# EAGLE design LED-RingCoder (EAGLE 6.5.0)
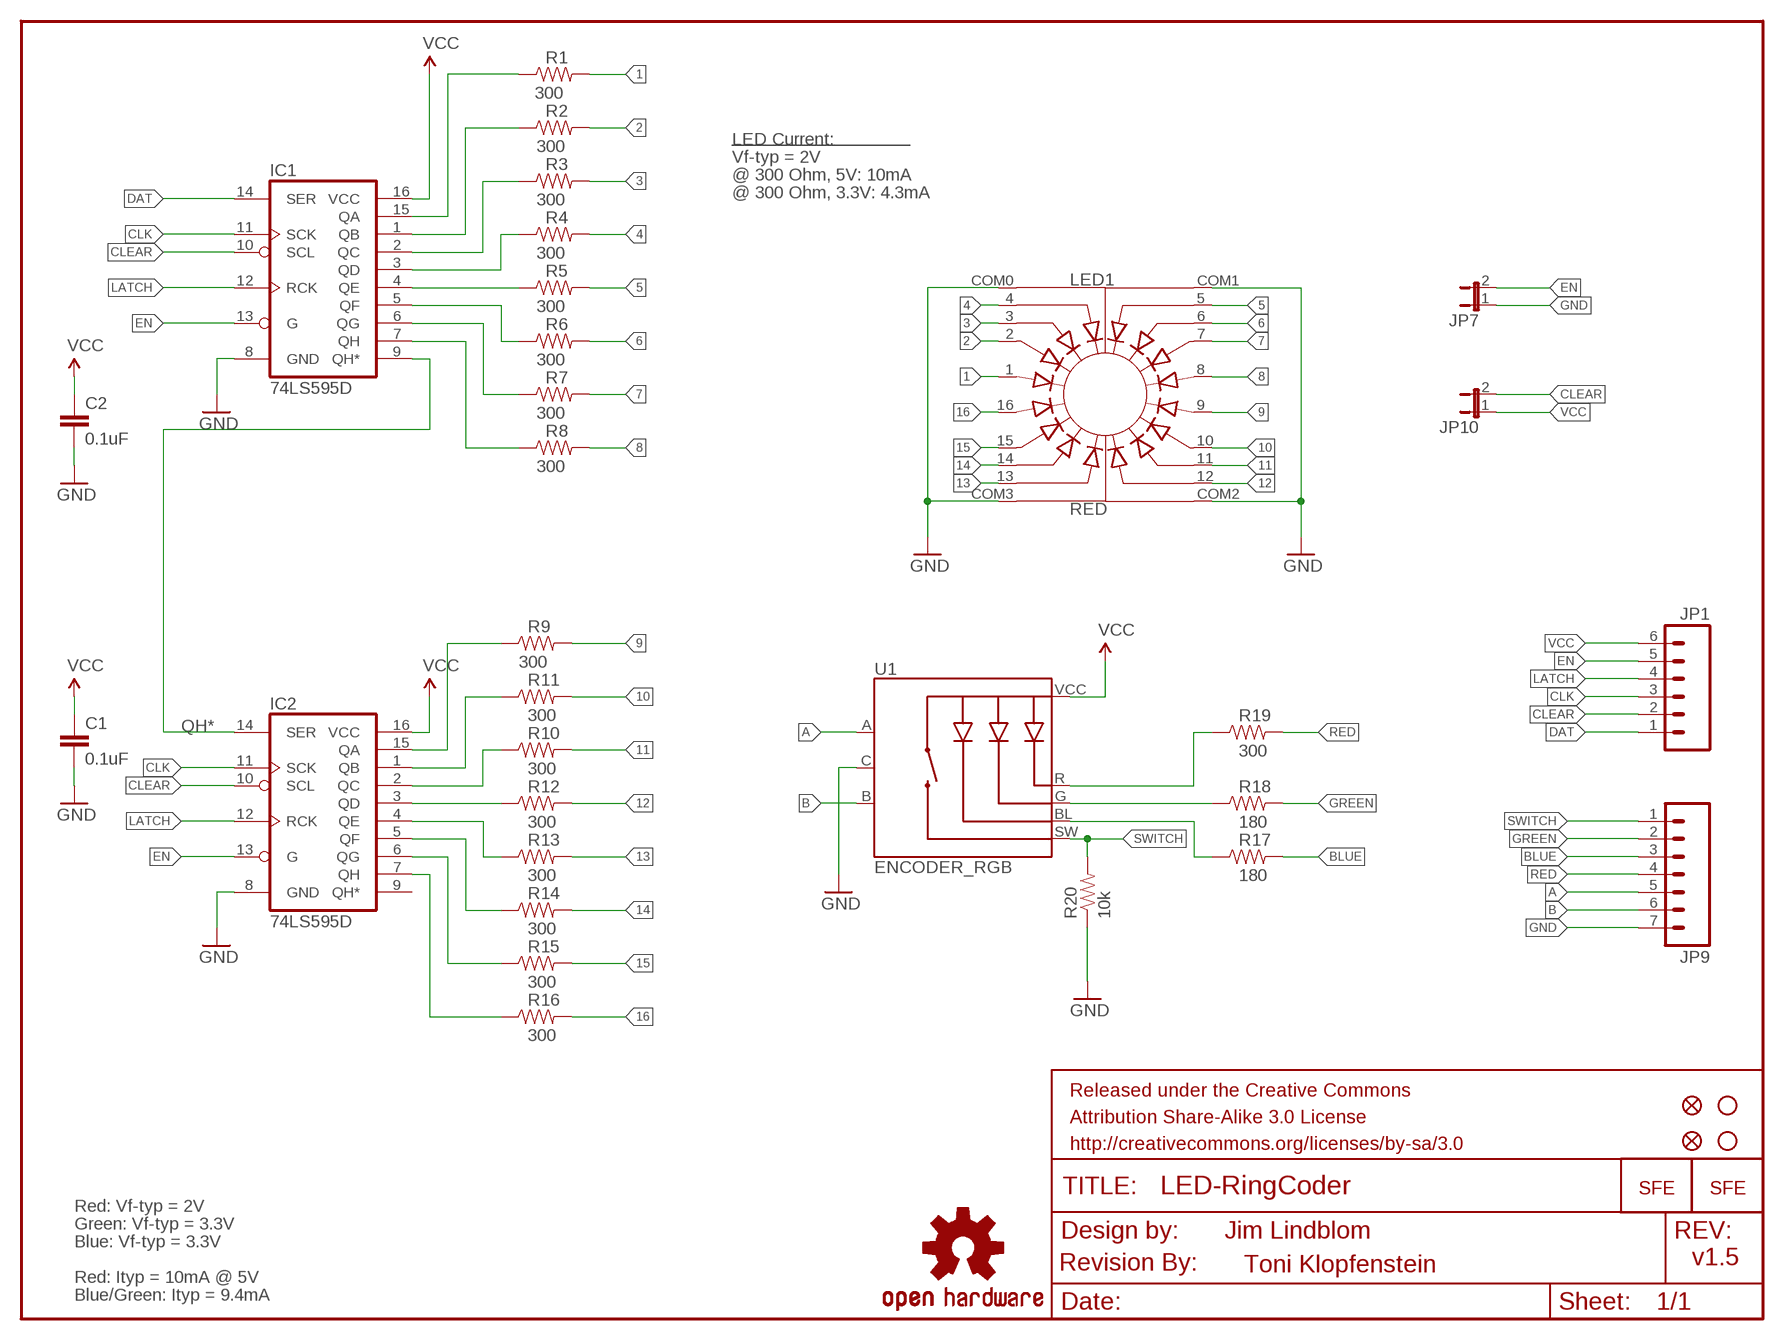
[diagram p0: schematic, sheet 1]

## Parts
C1  0.1uF  0.1UF-25V(+80/-20%)(0603)  [0603-CAP]
C2  0.1uF  0.1UF-25V(+80/-20%)(0603)  [0603-CAP]
FRAME1  FRAME-LETTER  [CREATIVE_COMMONS]
IC1  74LS595D  [SO16]
IC2  74LS595D  [SO16]
JP1  M06SIP  [1X06]
JP2  LOGO-SFENW2  [SFE-NEW-WEB]
JP3  STAND-OFF  [STAND-OFF]
JP4  STAND-OFF  [STAND-OFF]
JP5  FIDUCIAL1X2.5  [FIDUCIAL-1X2.5]
JP6  LOGO-SFESK  [SFE-LOGO-FLAME]
JP7  JUMPER-2SMD-NC  [SJ_2S]
JP8  FIDUCIAL1X2.5  [FIDUCIAL-1X2.5]
JP9  M07  [1X07]
JP10  JUMPER-2SMD-NC  [SJ_2S]
LED1  RED  LED_RING  [LED_RING]
R1  300  300OHM-1/10W-1%(0603)  [0603-RES]
R2  300  300OHM-1/10W-1%(0603)  [0603-RES]
R3  300  300OHM-1/10W-1%(0603)  [0603-RES]
R4  300  300OHM-1/10W-1%(0603)  [0603-RES]
R5  300  300OHM-1/10W-1%(0603)  [0603-RES]
R6  300  300OHM-1/10W-1%(0603)  [0603-RES]
R7  300  300OHM-1/10W-1%(0603)  [0603-RES]
R8  300  300OHM-1/10W-1%(0603)  [0603-RES]
R9  300  300OHM-1/10W-1%(0603)  [0603-RES]
R10  300  300OHM-1/10W-1%(0603)  [0603-RES]
R11  300  300OHM-1/10W-1%(0603)  [0603-RES]
R12  300  300OHM-1/10W-1%(0603)  [0603-RES]
R13  300  300OHM-1/10W-1%(0603)  [0603-RES]
R14  300  300OHM-1/10W-1%(0603)  [0603-RES]
R15  300  300OHM-1/10W-1%(0603)  [0603-RES]
R16  300  300OHM-1/10W-1%(0603)  [0603-RES]
R17  180  180OHM1/10W1%(0603)  [0603-RES]
R18  180  180OHM1/10W1%(0603)  [0603-RES]
R19  300  300OHM-1/10W-1%(0603)  [0603-RES]
R20  10k  10KOHM1/10W1%(0603)0603  [0603-RES]
U1  ENCODER_RGB  [ENCODER_LED_RGB]
U$1  REVISION  [REVISION]
U$2  OSHW-LOGOS  [OSHW-LOGO-S]

## Nets
1: LED1.1 R1.2
2: LED1.2 R2.2
3: LED1.3 R3.2
4: LED1.4 R4.2
5: LED1.5 R5.2
6: LED1.6 R6.2
7: LED1.7 R7.2
8: LED1.8 R8.2
9: LED1.9 R9.2
10: LED1.10 R11.2
11: LED1.11 R10.2
12: LED1.12 R12.2
13: LED1.13 R13.2
14: LED1.14 R14.2
15: LED1.15 R15.2
16: LED1.16 R16.2
A: JP9.5 U1.A
B: JP9.6 U1.B
BLUE: JP9.3 R17.2
CLEAR: IC1.10(SCL) IC2.10(SCL) JP1.2 JP10.2
CLK: IC1.11(SCK) IC2.11(SCK) JP1.3
DAT: IC1.14(SER) JP1.1
EN: IC1.13(G) IC2.13(G) JP1.5 JP7.2
GND: C1.2 C2.2 IC1.8(GND) IC2.8(GND) JP7.1 JP9.7 LED1.COM0 LED1.COM1 LED1.COM2 LED1.COM3 R20.1 U1.C
GREEN: JP9.2 R18.2
LATCH: IC1.12(RCK) IC2.12(RCK) JP1.4
LED-B: R17.1 U1.BL
LED-G: R18.1 U1.G
LED-R: R19.1 U1.R
N$1: IC1.15(QA) R1.1
N$2: IC1.1(QB) R2.1
N$3: IC1.2(QC) R3.1
N$4: IC1.3(QD) R4.1
N$5: IC1.4(QE) R5.1
N$6: IC1.5(QF) R6.1
N$7: IC1.6(QG) R7.1
N$8: IC1.7(QH) R8.1
N$9: IC2.15(QA) R9.1
N$10: IC2.1(QB) R11.1
N$11: IC2.2(QC) R10.1
N$12: IC2.3(QD) R12.1
N$13: IC2.4(QE) R13.1
N$14: IC2.5(QF) R14.1
N$15: IC2.6(QG) R15.1
N$16: IC2.7(QH) R16.1
QH*: IC1.9(QH*) IC2.14(SER)
RED: JP9.4 R19.2
SWITCH: JP9.1 R20.2 U1.SW
VCC: C1.1 C2.1 IC1.16(VCC) IC2.16(VCC) JP1.6 JP10.1 U1.VCC
Unconnected: IC2.9(QH*)

## Notes on the sheet
- LED Current:
- Vf-typ = 2V
- @ 300 Ohm, 5V: 10mA
- @ 300 Ohm, 3.3V: 4.3mA
- Red: Vf-typ = 2V
- Green: Vf-typ = 3.3V
- Jim Lindblom
- Blue: Vf-typ = 3.3V
- v1.5
- Toni Klopfenstein
- Red: Ityp = 10mA @ 5V
- Blue/Green: Ityp = 9.4mA

## Library data of the parts
C1 C2 = SparkFun-Capacitors:0.1UF-25V(+80/-20%)(0603): CAP-00810 Ceramic Standard decoupling cap; PROD_ID: CAP-00810
FRAME1 = SparkFun-Aesthetics:FRAME-LETTER: Schematic Frame Standard 8.5x11 US Letter frame
IC1 IC2 = SparkFun-DigitalIC:74*595: 8-bit SHIFT REGISTER, output latch
JP1 = SparkFun:M06: Header 6 Standard 6-pin 0.1" header. Use with straight break away headers (SKU : PRT-00116), right angle break away headers (PRT-00553), swiss pins (PRT-00743), machine pins (PRT-00117), and female headers (PRT-00115). Molex polarized connector foot print use with SKU : PRT-08094 with associated crimp pins and housings. NOTES ON THE VARIANTS LOCK and LOCK_LONGPADS... This footprint was designed to help hold the alignment of a through-hole component (i.e. 6-pin header) while soldering it into place. You may notice that each hole has been shifted either up or down by 0.005 of an inch from it's more standard position (which is a perfectly straight line). This slight alteration caused the pins (the squares in the middle) to touch the edges of the holes. Because they are alternating, it causes a "brace" to hold the component in place. 0.005 has proven to be the perfect amount of "off-center" position when using our standard breakaway headers. Although looks a little odd when you look at the bare footprint, once you have a header in there, the alteration is very hard to notice. Also, if you push a header all the way into place, it is covered up entirely on the bottom side. This idea of altering the position of holes to aid alignment will be further integrated into the Sparkfun Library for other footprints. It can help hold any component with 3 or more connection pins.
JP2 JP6 = SparkFun:LOGO-SFE: Spark Fun Electronics PCB Logo This is the standard Spark Fun Electronics PCB logo.
JP3 JP4 = SparkFun:STAND-OFF: Stand Off This is the mechanical footprint for a #4 phillips button head screw. Use the keepout ring to avoid running the screw head into surrounding components. SKU : PRT-00447
JP5 JP8 = abes:FIDUCIAL: Fiducial Alignment Points Various fiducial points for machine vision alignment.
JP7 JP10 = SparkFun-Passives:JUMPER-2: Jumper Basic 0.1" spaced jumper. Use with breakaway headers.
JP9 = SparkFun:M07: Header 7 Standard 7-pin 0.1" header. Use with straight break away headers (SKU : PRT-00116), right angle break away headers (PRT-00553), swiss pins (PRT-00743), machine pins (PRT-00117), and female headers (PRT-00115). NOTES ON THE VARIANTS LOCK and LOCK_LONGPADS... This footprint was designed to help hold the alignment of a through-hole component (i.e. 7-pin header) while soldering it into place. You may notice that each hole has been shifted either up or down by 0.005 of an inch from it's more standard position (which is usually a perfectly straight line). This slight alteration caused the pins (the squares in the middle) to touch the edges of the holes. Because they are alternating, it causes a "brace" to hold the header in place. 0.005 has proven to be the perfect amount of "off-center" position when using our standard breakaway headers. Although looks a little odd when you look at the bare footprint, once you have a header in there, the alteration is very hard to notice. Also, if you push a header all the way into place, it is covered up entirely on the bottom side. This idea of altering the position of holes to aid alignment will be further integrated into the Sparkfun Library for other footprints. It can help hold any component with 3 or more connection pins.
LED1 = SparkFun:LED_RING: 16 LED Ring http://dlnmh9ip6v2uc.cloudfront.net/datasheets/Components/LED/Top-Up%20LED%20Ring%20LED-CCL-A.pdf
R1-R16 R19 = SparkFun-Resistors:300OHM-1/10W-1%(0603): RES-10328; PROD_ID: RES_10328
R17 R18 = SparkFun-Resistors:180OHM1/10W1%(0603): RES-08788; PROD_ID: RES-08788
R20 = SparkFun-Resistors:10KOHM1/10W1%(0603): RES-00824; PROD_ID: RES-00824; VALUE: 10K
U1 = SparkFun:ENCODER_RGB: Illuminated Rotary Encoder w/ RGB LED and select switch EC12PLRGBSDVBF-D: http://top-up.so-buy.com/front/bin/ptdetail.phtml?Part=EC12PLRGBSDVBF-D
U$1 = SparkFun-Aesthetics:REVISION
U$2 = SparkFun:OSHW-LOGO: Open Source Hardware Logo This logo indicates the piece of hardware it is found on incorporates a OSHW license and/or adheres to the definition of open source hardware found here: http://freedomdefined.org/OSHW

## Board
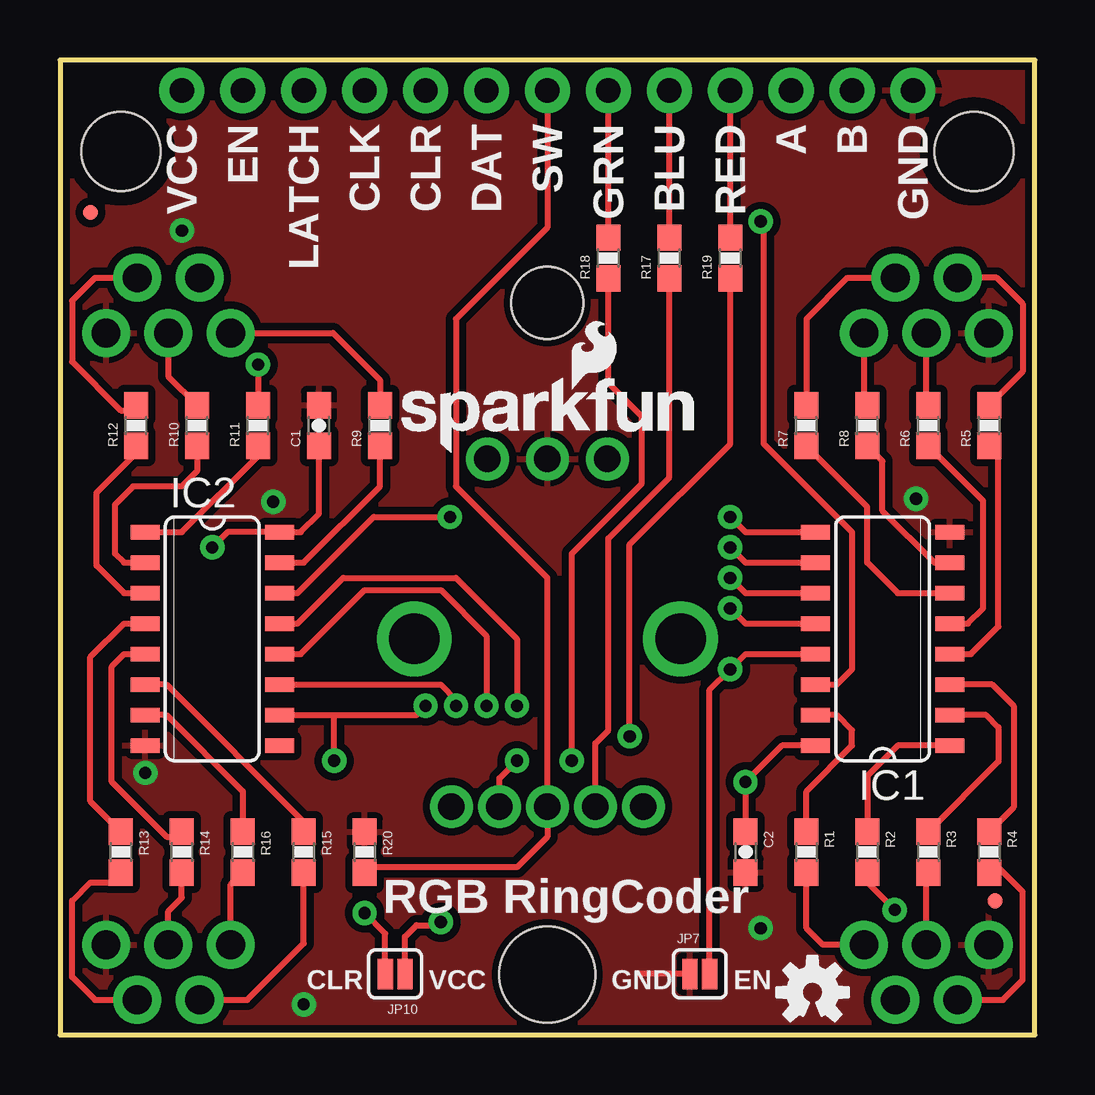
[diagram p1: board, top side]
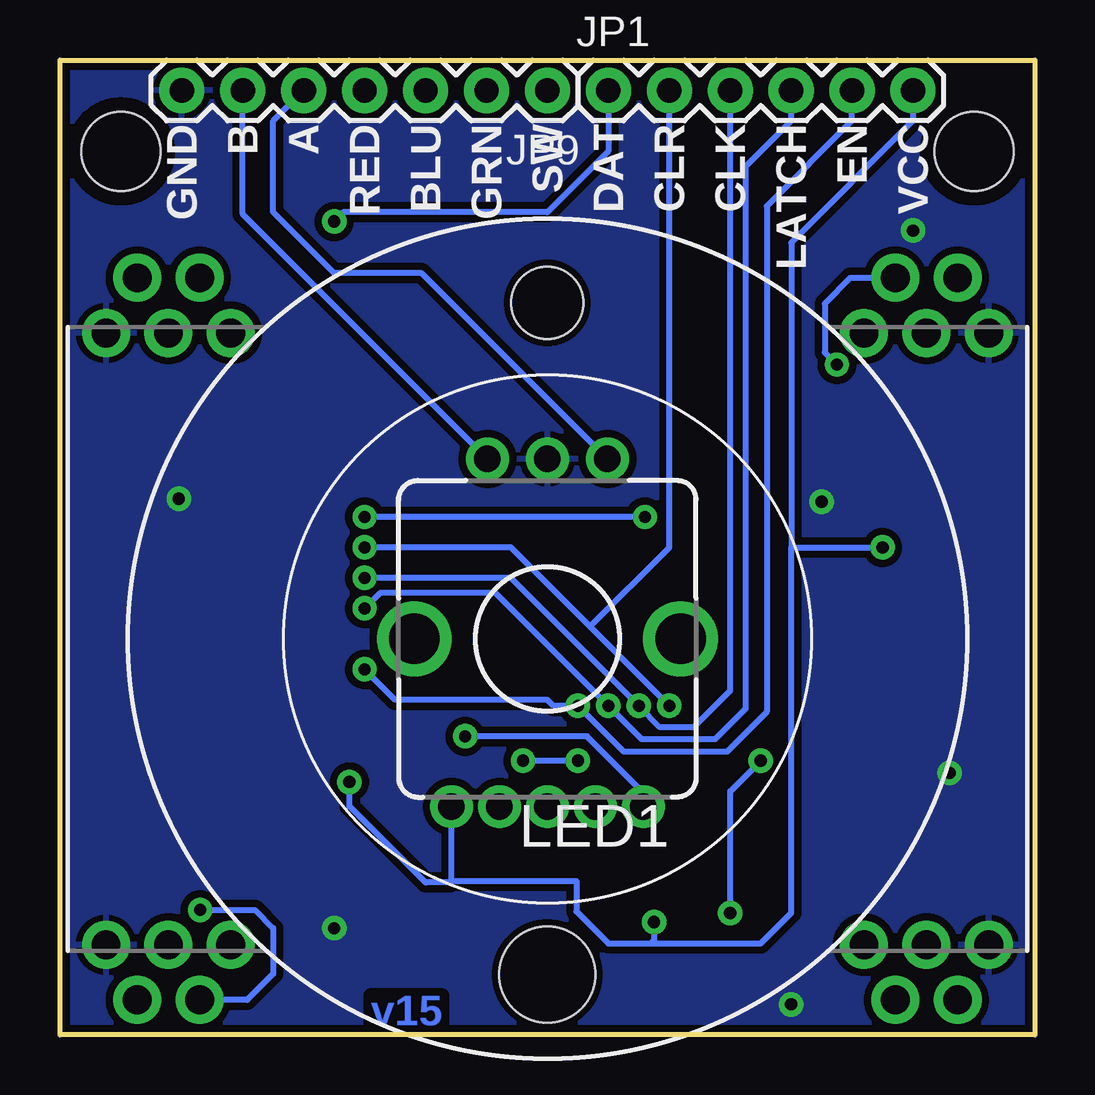
[diagram p2: board, bottom side, seen from below]

Size 40.64 x 40.64 mm. Coordinates in mm from the lower left corner, seen from the top.
Outline: 40.64,0 40.64,40.64 0,40.64 0,0 40.64,0
Copper layers (1*16): Top 0.035mm / dielectric 1.5mm / Bottom 0.035mm
Design rules "SparkFun *": minimum track width 8mil, minimum drill 20mil, track to track 8mil, track to pad 8mil, pad to pad 8mil, via to via 8mil, smd to smd 8mil, copper to edge 8mil, drill to drill 8mil, minimum pad ring 12mil, minimum via ring 10mil, stop-mask expansion 4mil, vias tented up to drill 20mil, thermal gap 10mil

### Footprints (pad centres in the part's own frame; a part is rotated, then mirrored left to right if it is on the bottom)
0603-CAP = smd 1.1 x 1: 1 -0.85,0; 2 0.85,0
SO16 = smd 0.6 x 1.2: 1 -4.445,-2.8; 2 -3.175,-2.8; 3 -1.905,-2.8; 4 -0.635,-2.8; 5 0.635,-2.8; 6 1.905,-2.8; 7 3.175,-2.8; 8 4.445,-2.8; 9 4.445,2.8; 10 3.175,2.8; 11 1.905,2.8; 12 0.635,2.8; 13 -0.635,2.8; 14 -1.905,2.8; 15 -3.175,2.8; 16 -4.445,2.8
1X06 = drill 1.016 pad 1.88: 1 0,0; 2 2.54,0; 3 5.08,0; 4 7.62,0; 5 10.16,0; 6 12.7,0
STAND-OFF = hole 3.302: 0,0
FIDUCIAL-1X2.5 = smd 0.635 x 0.635: 1 0,0
SJ_2S = smd 0.635 x 1.27: 1 -0.412,0; 2 0.412,0
1X07 = drill 1.016 pad 1.88: 1 0,0; 2 2.54,0; 3 5.08,0; 4 7.62,0; 5 10.16,0; 6 12.7,0; 7 15.24,0
LED_RING = drill 1.2 pad 2: 1 13.2,12.75; 2 14.5,15.05; 3 15.8,12.75; 4 17.1,15.05; 5 17.1,-15.05; 6 15.8,-12.75; 7 14.5,-15.05; 8 13.2,-12.75; 9 -13.2,-12.75; 10 -14.5,-15.05; 11 -15.8,-12.75; 12 -17.1,-15.05; 13 -17.1,15.05; 14 -15.8,12.75; 15 -14.5,15.05; 16 -13.2,12.75; COM0 18.4,12.75; COM1 18.4,-12.75; COM2 -18.4,-12.75; COM3 -18.4,12.75 | hole 4: 0,14 | hole 3: 0,-14
0603-RES = smd 1.1 x 1: 1 -0.85,0; 2 0.85,0
ENCODER_LED_RGB = drill 1.1 pad 1.8: A -2.5,-7.5; B 2.5,-7.5; C 0,-7.5 | drill 1.1 pad 1.778: BL 2,7; G -2,7; R -4,7; SW 0,7; VCC 4,7 | drill 2.1: P$1 -5.55,0; P$2 5.55,0

### Placement (x,y rotation side)
C1  10.79,25.4 90 top
C2  28.57,7.62 270 top
FRAME1  -3.28,-9.53 0 top  (outside the outline)
IC1  34.29,16.51 90 top
IC2  6.35,16.51 270 top
JP1  17.78,39.37 0 bottom
JP2  14.22,24.26 0 top
JP3  38.1,36.83 0 bottom
JP4  2.54,36.83 0 bottom
JP5  38.99,5.59 0 top
JP6  21.34,26.92 0 top
JP7  26.67,2.54 0 top
JP8  1.27,34.29 0 top
JP9  20.32,39.37 180 bottom
JP10  13.97,2.54 180 top
LED1  20.32,16.51 180 bottom
R1  31.11,7.62 270 top
R2  33.66,7.62 270 top
R3  36.2,7.62 270 top
R4  38.73,7.62 270 top
R5  38.73,25.4 90 top
R6  36.2,25.4 90 top
R7  31.11,25.4 90 top
R8  33.66,25.4 90 top
R9  13.34,25.4 90 top
R10  5.71,25.4 90 top
R11  8.26,25.4 90 top
R12  3.17,25.4 90 top
R13  2.54,7.62 270 top
R14  5.08,7.62 270 top
R15  10.16,7.62 270 top
R16  7.62,7.62 270 top
R17  25.4,32.38 90 top
R18  22.86,32.38 90 top
R19  27.94,32.38 90 top
R20  12.7,7.62 270 top
U1  20.32,16.51 180 bottom
U$1  8.26,-12.7 0 top  (outside the outline)
U$2  31.37,1.78 0 top

### Tracks (layer width: path | path; a pad name or v marks a point on that pad's centre or on a via)
1
  Top 0.254: LED1.1 31.8,3.76 31.11,4.45 R1.2
2  (via drill 0.51)
  Top 0.254: R2.2 33.44,6.77 33.44,6.57 v34.8,5.21
  Bottom 0.254: LED1.2 32.83,1.46 31.75,2.54 31.75,4.45 32.51,5.21 v34.8,5.21
3
  Top 0.254: LED1.3 36.12,6.7 R3.2
4
  Top 0.254: LED1.4 39.31,1.46 40.13,2.29 40.13,5.97 39.13,6.97 38.94,6.97 R4.2
5
  Top 0.254: LED1.5 39.05,31.56 40.13,30.48 40.13,27.65 R5.2
6
  Top 0.254: LED1.6 36.12,26.32 R6.2
7
  Top 0.254: LED1.7 32.83,31.56 31.11,29.84 R7.2
8
  Top 0.254: LED1.8 33.52,26.39 R8.2
9
  Top 0.254: LED1.9 11.38,29.26 13.34,27.3 R9.2
10  (via drill 0.51)
  Top 0.254: 8.04,26.04 R11.2 v8.26,27.94
  Bottom 0.254: LED1.10 7.68,31.56 8.76,30.48 8.76,28.45 v8.26,27.94
11
  Top 0.254: LED1.11 4.52,27.45 R10.2
12
  Top 0.254: LED1.12 1.46,31.56 0.51,30.61 0.51,28.07 2.54,26.04 2.96,26.04 R12.2
13
  Top 0.254: LED1.13 1.46,1.46 0.51,2.41 0.51,5.59 1.27,6.35 2.12,6.35 R13.2
14
  Top 0.254: LED1.14 4.52,5.16 5.08,5.71 R14.2
15
  Top 0.254: LED1.15 7.81,1.46 10.16,3.81 R15.2
16
  Top 0.254: LED1.16 7.12,6.27 R16.2
A
  Bottom 0.254: U1.A 25.56,31.75 29.21,31.75 31.75,34.29 31.75,38.1 JP9.5
B
  Bottom 0.254: JP9.6 33.02,34.21 U1.B
BLUE
  Top 0.254: R17.2 JP9.3
CLEAR  (via drill 0.51)
  Top 0.254: IC1.10 28.57,19.68 v27.94,20.32 | IC2.10 11.43,13.34 | 11.43,13.34 14.86,13.34 v15.24,13.72 | JP10.2 13.56,4.22 v12.7,5.08 | v11.43,11.43 11.43,13.34
  Bottom 0.254: v15.24,13.72 18.54,17.02 | 18.54,17.02 21.84,20.32 v27.94,20.32 | JP1.2 15.24,20.32 18.54,17.02 | v12.7,5.08 12.7,10.16 v11.43,11.43
CLK  (via drill 0.51)
  Top 0.254: IC1.11 28.57,18.41 v27.94,19.05 | IC2.11 15.88,14.61 16.51,13.97 v16.51,13.72
  Bottom 0.254: v27.94,19.05 21.84,19.05 v16.51,13.72 15.62,12.83 14.22,12.83 12.7,14.35 JP1.3
DAT  (via drill 0.51)
  Top 0.254: IC1.14 32.38,14.61 33.02,15.24 33.02,20.95 29.34,24.64 29.34,33.78 v29.21,33.91
  Bottom 0.254: JP1.1 17.78,36.83 20.32,34.29 28.83,34.29 v29.21,33.91
EN  (via drill 0.51)
  Top 0.254: IC1.13 28.57,15.88 v27.94,15.24 27.08,14.38 JP7.2 | IC2.13 9.91,17.14 11.81,19.05 16.51,19.05 19.05,16.51 v19.05,13.72
  Bottom 0.254: v27.94,15.24 26.67,13.97 20.32,13.97 20.07,13.72 v19.05,13.72 17.14,11.81 12.83,11.81 11.18,13.46 11.18,34.54 7.62,38.1 JP1.5
GND  (via drill 0.51)
  Top 0.254: C1.2 10.79,26.67 | JP7.1 24.13,2.54
  other vias: 35.69,22.35 3.56,10.92 29.21,4.45 5.08,33.53 8.89,22.23 10.16,1.27
  pour Top (isolate 0.305): 40.64,0 40.64,40.64 0,40.64 0,0
  pour Bottom (isolate 0.305): 40.64,0 40.64,40.64 0,40.64 0,0
GREEN
  Top 0.254: R18.2 JP9.2
LATCH  (via drill 0.51)
  Top 0.254: IC1.12 28.57,17.14 v27.94,17.78 | IC2.12 10.03,15.88 12.7,18.54 15.88,18.54 17.78,16.64 v17.78,13.72
  Bottom 0.254: v27.94,17.78 27.3,18.41 22.48,18.41 v17.78,13.72 16.38,12.32 13.34,12.32 12.06,13.59 12.06,36.2 10.16,38.1 JP1.4
LED-B
  Top 0.254: R17.1 25.4,23.24 22.86,20.7 22.86,12.7 22.32,12.16 U1.BL
LED-G  (via drill 0.51)
  Top 0.254: v19.05,11.43 18.32,10.7 U1.G | v21.34,11.43 21.34,20.07 24.26,22.99 24.26,25.78 22.86,27.18 R18.1
  Bottom 0.254: v19.05,11.43 v21.34,11.43
LED-R  (via drill 0.51)
  Top 0.254: v23.75,12.45 23.75,20.45 27.94,24.64 R19.1
  Bottom 0.254: v23.75,12.45 18.67,12.45 16.32,10.1 U1.R
N$1
  Top 0.254: IC1.15 32.38,13.34 33.02,12.7 33.02,12.06 31.11,10.16 R1.1
N$2
  Top 0.254: IC1.1 34.92,12.06 33.66,10.79 R2.1
N$3
  Top 0.254: IC1.2 38.61,13.34 39.12,12.83 39.12,11.39 R3.1 | 36.2,8.89 R3.1 | R3.1 36.2,8.26
N$4
  Top 0.254: IC1.3 38.86,14.61 39.75,13.72 39.75,9.49 R4.1
N$5
  Top 0.254: IC1.4 37.97,15.88 39.12,17.02 39.12,24.17 R5.1
N$6
  Top 0.254: IC1.5 37.85,17.14 38.48,17.78 38.48,22.26 R6.1
N$7
  Top 0.254: IC1.6 34.92,18.41 33.66,19.68 33.66,22.01 R7.1
N$8
  Top 0.254: IC1.7 36.45,19.68 34.29,21.84 34.29,23.91 R8.1
N$9
  Top 0.254: IC2.15 10.16,19.68 13.34,22.86 R9.1
N$10
  Top 0.254: IC2.1 5.08,20.95 8.26,24.13 R11.1
N$11
  Top 0.254: IC2.2 2.67,19.68 2.29,20.07 2.29,22.1 3.05,22.86 5.08,22.86 5.71,23.5 R10.1
N$12
  Top 0.254: IC2.3 2.67,18.41 1.52,19.56 1.52,22.61 3.17,24.26 R12.1
N$13
  Top 0.254: IC2.4 2.67,17.14 1.27,15.75 1.27,9.74 R13.1
N$14
  Top 0.254: IC2.5 2.67,15.88 2.16,15.37 2.16,10.54 4.45,8.26 4.87,8.26 R14.1
N$15
  Top 0.254: IC2.6 4.45,14.61 10.16,8.89 R15.1
N$16
  Top 0.254: IC2.7 4.45,13.34 7.62,10.16 R16.1
QH*  (via drill 0.51)
  Top 0.254: IC1.9 28.57,20.95 v27.94,21.59 | IC2.14 9.91,18.41 13.08,21.59 v16.26,21.59
  Bottom 0.254: v16.26,21.59 v27.94,21.59
RED
  Top 0.254: R19.2 JP9.4
SWITCH
  Top 0.254: R20.2 12.91,6.99 19.05,6.99 20.32,8.26 U1.SW 20.32,19.05 16.51,22.86 16.51,29.84 20.32,33.66 JP9.1
VCC  (via drill 0.51)
  Top 0.254: C2.1 v28.57,10.54 30.1,12.06 IC1.16 | C1.1 10.79,21.72 10.03,20.95 IC2.16 6.99,20.95 v6.35,20.32 | JP10.1 14.38,4.09 14.86,4.57 15.75,4.57 v15.88,4.7
  Bottom 0.254: 24.32,6.41 U1.VCC | 24.32,6.41 24.38,6.35 25.4,6.35 28.57,9.53 v28.57,10.54 | JP1.6 5.08,38.1 10.16,33.02 10.16,20.32 | 10.16,20.32 10.16,5.08 11.43,3.81 16,3.81 | 10.16,20.32 v6.35,20.32 | 24.32,6.41 19.11,6.41 19.11,5.14 17.78,3.81 16,3.81 | v15.88,4.7 15.88,3.94 16,3.81

### Text on the board
Bottom: v15
tPlace: VCC | EN | LATCH | CLK | CLR | DAT | SW | GRN | BLU | RED | A | B | GND | RGB RingCoder | CLR | VCC | GND | EN
bPlace: VCC | EN | LATCH | CLK | CLR | DAT | SW | GRN | BLU | RED | A | B | GND
tDocu: Jim Lindblom | Toni Klopfenstein